# Altium schematic sheet Card Edge Connector.SchDoc: Card Edge Connector
size 292 x 193 mm; SheetNumber: 2; SheetTotal: 14
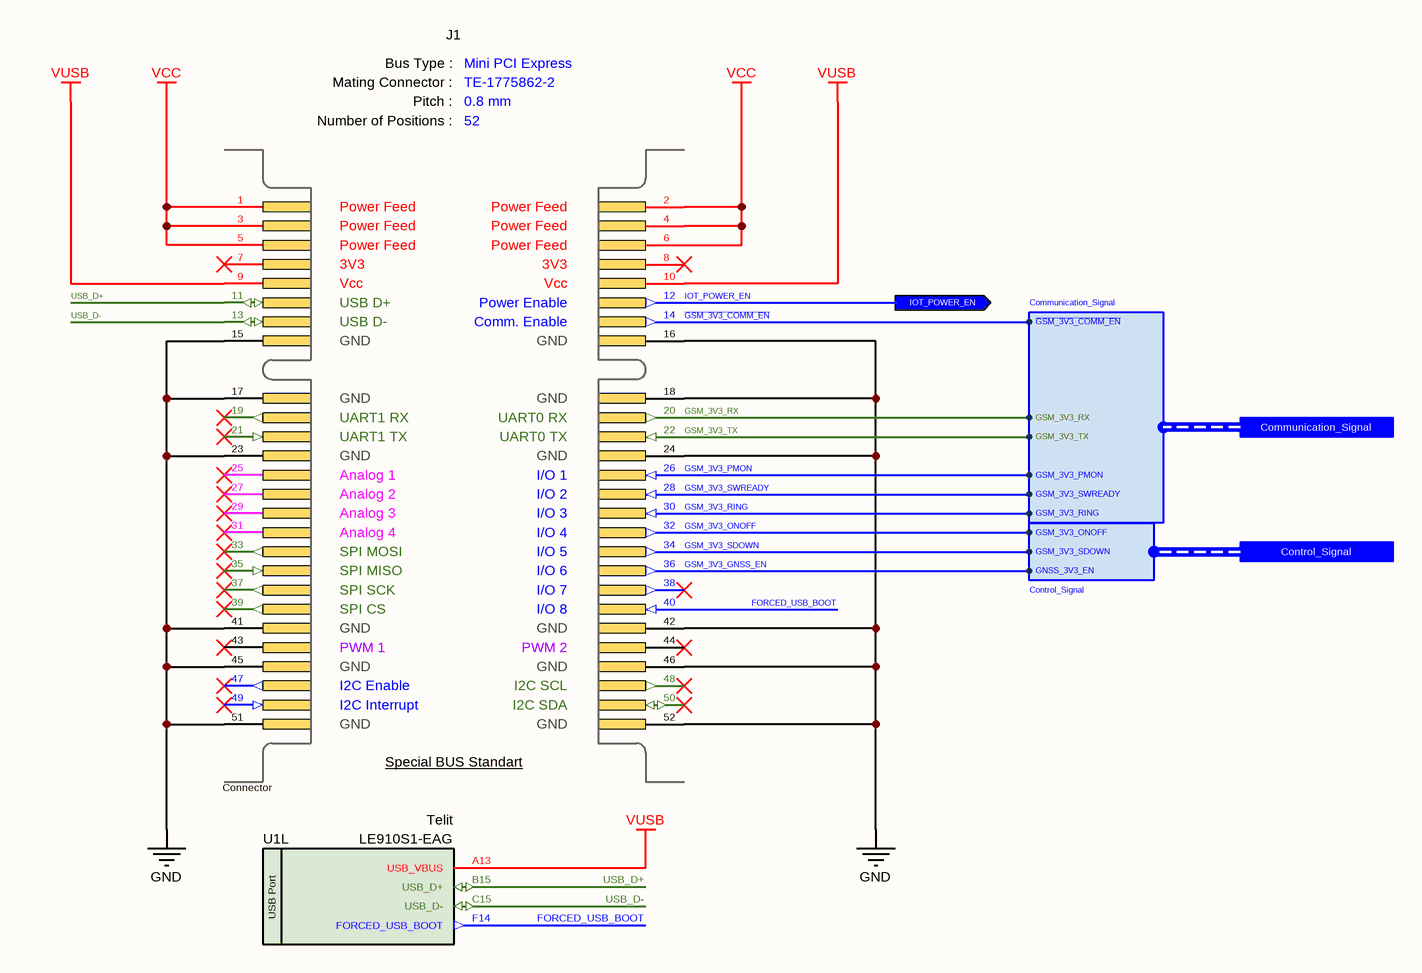
[diagram p0: Card Edge Connector.SchDoc]

## Parts
J1  BUS Type: Mini PCI Express  Mating Connector: TE-1775862-2  Pitch: 0.8 mm  Number of Positions: 52  System: Connector  [PCB - Mini PCI Express]  (hidden comment: Connector - Mini PCI-E [Add-on])  (no BOM)
U1  Manufacturer Part Number: LE910S1-EAG  Manufacturer Name: Telit  [LE910 GSM Modem]  (hidden comment: LE910S1-EAG LTE GSM Module)  (part L of 19)

## Ports
Communication_Signal (harness Communication_Signal), Control_Signal (harness Control_Signal), IOT_POWER_EN (out)

## Harnesses
Communication_Signal: GSM_3V3_PMON, GSM_3V3_SWREADY, GSM_3V3_RING, ~{GSM_3V3_COMM_EN}, GSM_3V3_TX, GSM_3V3_RX
Control_Signal: GSM_3V3_ONOFF, GSM_3V3_SDOWN, GNSS_3V3_EN

## Nets
GND: J1.15(Pin-15) J1.16(Pin-16) J1.17(Pin-17) J1.18(Pin-18) J1.23(Pin-23) J1.24(Pin-24) J1.41(Pin-41) J1.42(Pin-42) J1.45(Pin-45) J1.46(Pin-46) J1.51(Pin-51) J1.52(Pin-52)
VCC: J1.1(Pin-1) J1.2(Pin-2) J1.3(Pin-3) J1.4(Pin-4) J1.5(Pin-5) J1.6(Pin-6)
VUSB: J1.9(Pin-9) J1.10(Pin-10) U1.A13(USB_VBUS)
FORCED_USB_BOOT: J1.40(Pin-40) U1.F14(FORCED_USB_BOOT)
~{GSM_3V3_COMM_EN}: J1.14(Pin-14) ; port Communication_Signal.~{GSM_3V3_COMM_EN}
GSM_3V3_GNSS_EN: J1.36(Pin-36) ; port Control_Signal.GNSS_3V3_EN
GSM_3V3_ONOFF: J1.32(Pin-32) ; port Control_Signal.GSM_3V3_ONOFF
GSM_3V3_PMON: J1.26(Pin-26) ; port Communication_Signal.GSM_3V3_PMON
GSM_3V3_RING: J1.30(Pin-30) ; port Communication_Signal.GSM_3V3_RING
GSM_3V3_RX: J1.20(Pin-20) ; port Communication_Signal.GSM_3V3_RX
GSM_3V3_SDOWN: J1.34(Pin-34) ; port Control_Signal.GSM_3V3_SDOWN
GSM_3V3_SWREADY: J1.28(Pin-28) ; port Communication_Signal.GSM_3V3_SWREADY
GSM_3V3_TX: J1.22(Pin-22) ; port Communication_Signal.GSM_3V3_TX
IOT_POWER_EN: J1.12(Pin-12) ; port IOT_POWER_EN
USB_D+: J1.11(Pin-11) U1.B15(USB_D+)
USB_D-: J1.13(Pin-13) U1.C15(USB_D-)

Not connected (* = marked no-connect by the designer): J1 7(Pin-7)* 8(Pin-8)* 19(Pin-19)* 21(Pin-21)* 25(Pin-25)* 27(Pin-27)* 29(Pin-29)* 31(Pin-31)* 33(Pin-33)* 35(Pin-35)* 37(Pin-37)* 38(Pin-38)* 39(Pin-39)* 43(Pin-43)* 44(Pin-44)* 47(Pin-47)* 48(Pin-48)* 49(Pin-49)* 50(Pin-50)*

## Notes on the sheet
- © 2021 All rights reserved.
  This document may not, in whole or in part, be copied, photocopied, reproduced, translated or converted to any electronic or machine readable from without prior written permission of Mehmet Günce Akkoyun.
  Engineer contact : akkoyun@me.com
- Property of
- Engineer :
- Date :
- Size :
- A4
- Time :
- Project :
- Page :
- /
- Customer :
- Product ID :
- Module ID :
- Version :
- File :
- Revision :
- (in symbol Connector - Mini PCI-E [Add-on]) Bus Type :; Mating Connector :; Pitch :; Number of Positions :; Power Feed; 3V3; Vcc; USB D+; Power Enable; USB D-; Comm. Enable; GND; UART1 RX; UART0 RX; UART1 TX; UART0 TX; Analog 1; I/O 1; Analog 2; I/O 2; Analog 3; I/O 3; Analog 4; I/O 4; SPI MOSI; I/O 5; SPI MISO; I/O 6; SPI SCK; I/O 7; SPI CS; I/O 8; PWM 1; PWM 2; I2C Enable; I2C SCL; I2C Interrupt; I2C SDA; Special BUS Standart
- (in symbol IC - LE910S1-EAG, part L) USB Port

## Library data of the parts
J1 = Connector - Mini PCI-E [Add-on]: Mini PCI-Express gold finger connector.
U1 = IC - LE910S1-EAG: Telit LE910S1-EAG GPRS/GNSS Module; Case: BGA